# EAGLE schematic main (EAGLE 6.5.0)
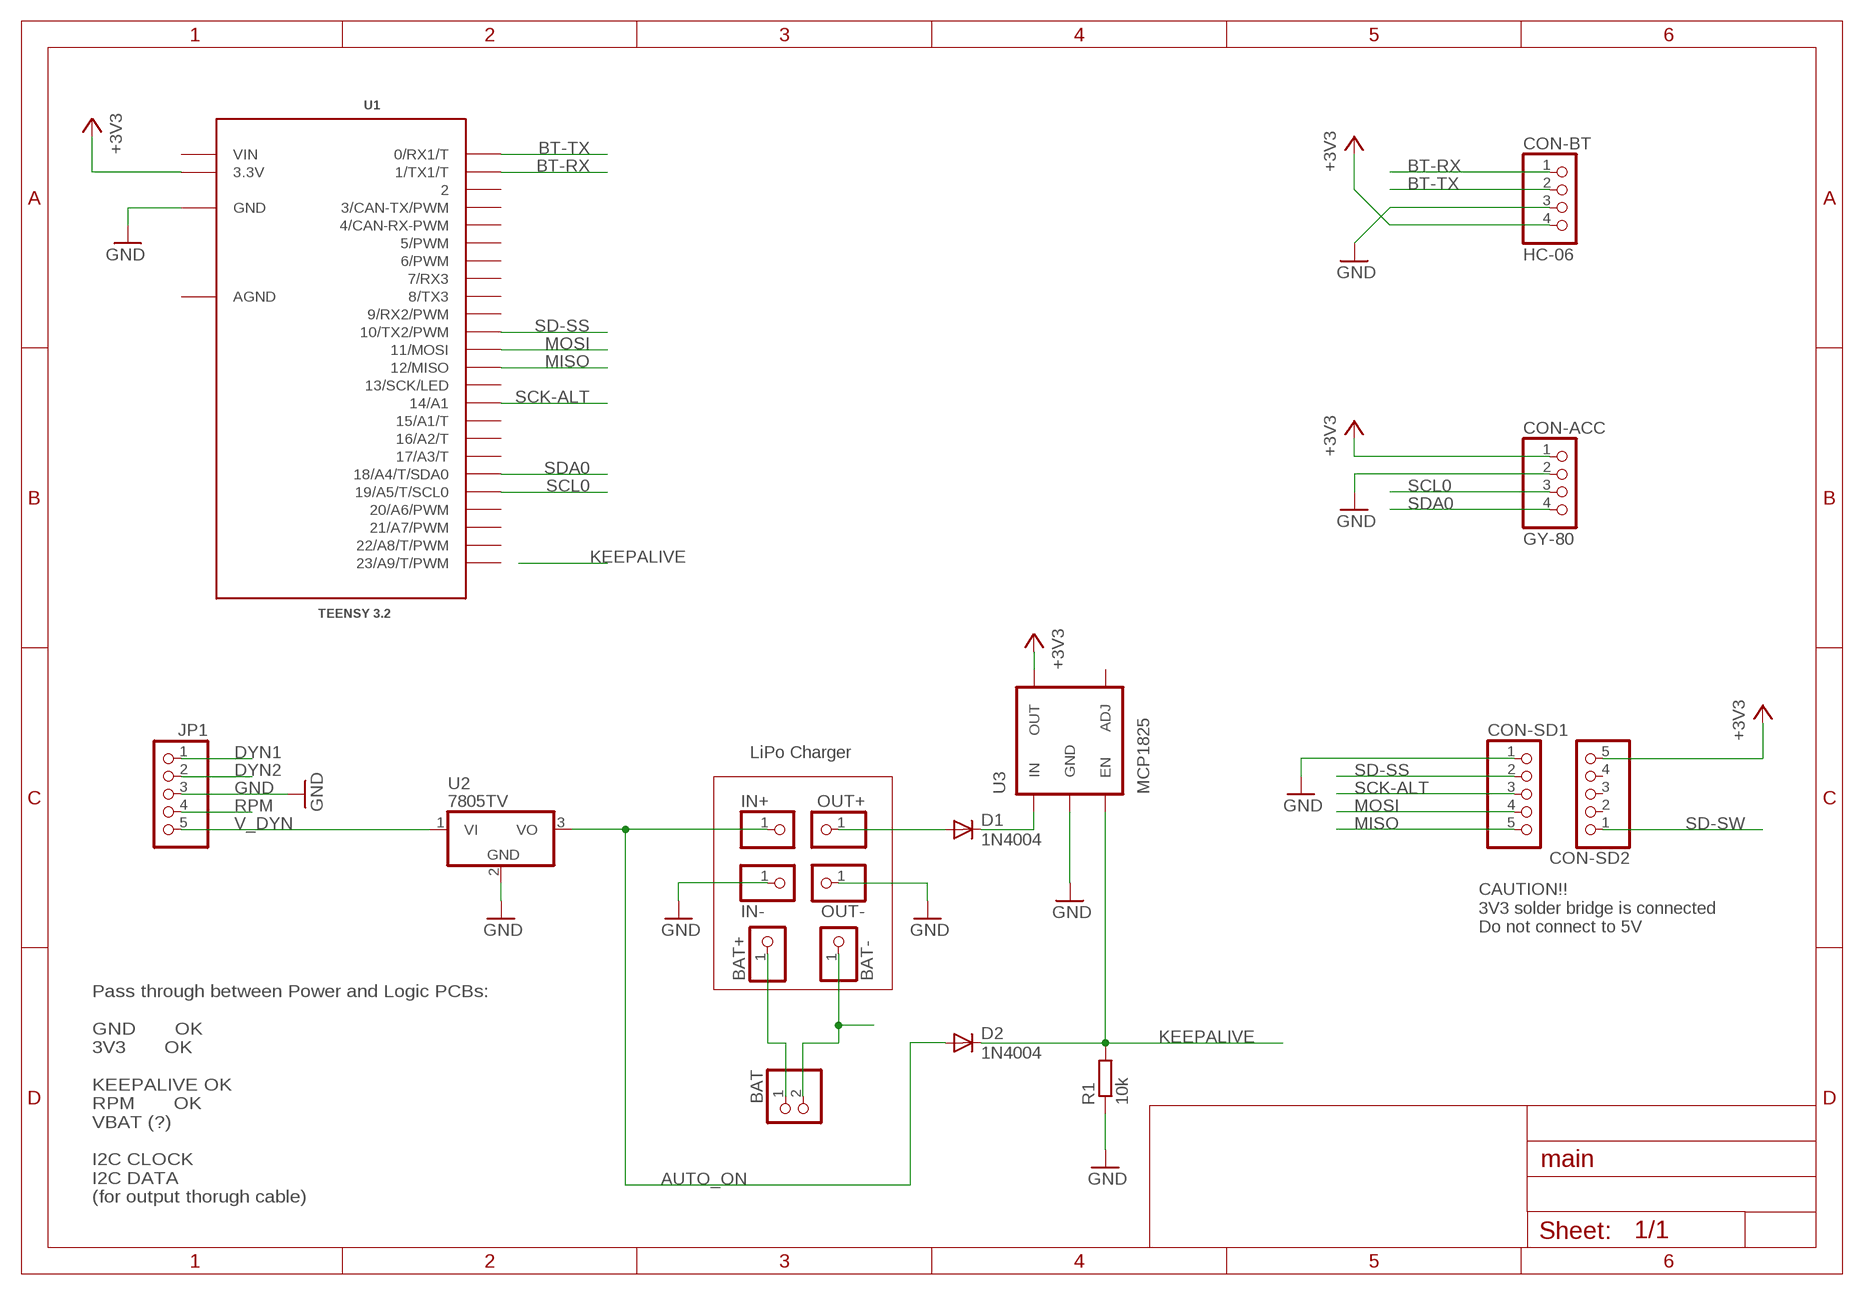
[diagram p0: schematic, sheet 1]

## Parts
BAT  PINHD-1X2  [1X02]
BAT+  PINHD-1X1  [1X01]
BAT-  PINHD-1X1  [1X01]
CON-ACC  GY-80  PINHD-1X4  [1X04]
CON-BT  HC-06  PINHD-1X4  [1X04]
CON-SD1  PINHD-1X5  [1X05]
CON-SD2  PINHD-1X5  [1X05]
D1  1N4004  [DO41-10]
D2  1N4004  [DO41-10]
IN+  PINHD-1X1  [1X01]
IN-  PINHD-1X1  [1X01]
JP1  PINHD-1X5  [1X05]
OUT+  PINHD-1X1  [1X01]
OUT-  PINHD-1X1  [1X01]
R1  10k  R-EU_0204/7  [0204/7]
U1  TEENSY 3.2  TEENSY_3.1_DIL  [TEENSY3-DIL]
U2  7805TV  [TO220V]
U3  MCP1825  MCP1824  [SOT23-5]

## Nets
+3V3: CON-ACC.1 CON-BT.4 CON-SD2.5 U1.3.3V U3.5(OUT)
AUTO_ON: D2.A IN+.1 U2.3(VO)
BAT+: BAT+.1 BAT.1
BT-RX: CON-BT.1 U1.1(1/TX1/T)
BT-TX: CON-BT.2 U1.0(0/RX1/T)
DYN1: JP1.1
DYN2: JP1.2
GND: CON-ACC.2 CON-BT.3 CON-SD1.1 IN-.1 JP1.3 OUT-.1 R1.1 U1.GND U2.2(GND) U3.2(GND)
KEEPALIVE: D2.C R1.2 U3.3(EN)
MISO: CON-SD1.5 U1.12(12/MISO)
MOSI: CON-SD1.4 U1.11(11/MOSI)
N$2: D1.C U3.1(IN)
N$5: BAT-.1 BAT.2
OUT+: D1.A OUT+.1
RPM: JP1.4
SCK-ALT: CON-SD1.3 U1.14/A0(14/A1)
SCL0: CON-ACC.3 U1.19/A5(19/A5/T/SCL0)
SD-SS: CON-SD1.2 U1.10(10/TX2/PWM)
SD-SW: CON-SD2.1
SDA0: CON-ACC.4 U1.18/A4(18/A4/T/SDA0)
V_DYN: JP1.5 U2.1(VI)
Unconnected: CON-SD2.2 CON-SD2.3 CON-SD2.4 U1.2 U1.3(3/CAN-TX/PWM) U1.4(4/CAN-RX-PWM) U1.5(5/PWM) U1.6(6/PWM) U1.7(7/RX3) U1.8(8/TX3) U1.9(9/RX2/PWM) U1.13(13/SCK/LED) U1.15/A1(15/A1/T) U1.16/A2(16/A2/T) U1.17/A3(17/A3/T) U1.20/A6(20/A6/PWM) U1.21/A7(21/A7/PWM) U1.22/A8(22/A8/T/PWM) U1.23/A9(23/A9/T/PWM) U3.4(ADJ)

## Notes on the sheet
- LiPo Charger
- CAUTION!!
  3V3 solder bridge is connected
  Do not connect to 5V
- Pass through between Power and Logic PCBs:
  
  GND       OK
  3V3       OK
  
  KEEPALIVE OK
  RPM       OK
  VBAT (?)
  
  I2C CLOCK
  I2C DATA
  (for output thorugh cable)

## Power pins joined to a net without a drawn wire
AGND: U1.AGND
VIN: U1.VIN

## Library data of the parts
BAT = pinhead:PINHD-1X2: PIN HEADER
BAT+ BAT- IN+ IN- OUT+ OUT- = pinhead:PINHD-1X1: PIN HEADER
CON-ACC CON-BT = pinhead:PINHD-1X4: PIN HEADER
CON-SD1 CON-SD2 JP1 = pinhead:PINHD-1X5: PIN HEADER
D1 D2 = adafruit:1N4004: DIODE General purpose 1N400x type rectifier (With bigger pads) http://www.ladyada.net/library/pcb/eaglelibrary.html
R1 = rcl:R-EU_: RESISTOR, European symbol
U1 = Teensy_3_and_LC_Series_Boards_v1.1:TEENSY_3.1_DIL: Teensy 3.1 or 3.2 in a DIL Layout.
U2 = linear:78*: Positive VOLTAGE REGULATOR Source: http://cache.national.com/ds/LM/LM78L05.pdf http://www.fairchildsemi.com/ds/LM/LM7805.pdf
U3 = bt_regulator:MCP1824: MCP1824 LDO voltage regulator The MCP1824/MCP1824S is a 300 mA Low Dropout (LDO) linear regulator that provides high current and low output voltages. The MCP1824 comes in a fixed or adjustable output voltage version, with an output voltage range of 0.8V to 5.0V. Datasheet.pdf <http://ww1.microchip.com/downloads/en/devicedoc/22070a.pdf>